# EAGLE design furballv3 (EAGLE 9.3.2)
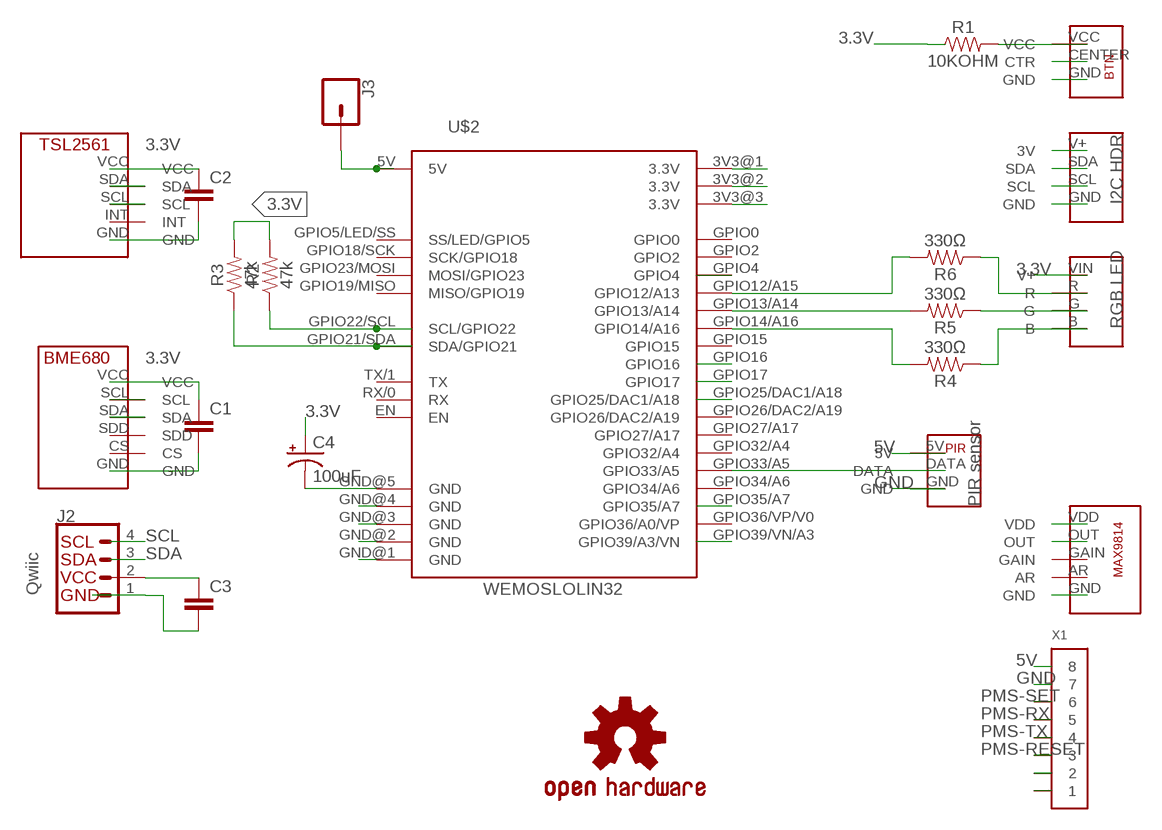
[diagram p0: schematic, sheet 1]

## Parts
C1  10pF  CAPPTH2  [CAP-PTH-SMALL2]
C2  10pF  CAPPTH2  [CAP-PTH-SMALL2]
C3  10pF  CAPPTH2  [CAP-PTH-SMALL2]
C4  100uF  100UF-POLAR-RADIAL-2.5MM-25V-20%  [CPOL-RADIAL-2.5MM-6.5MM]
J2  QWIIC_CONNECTORJS-1MM  [1X04_1MM_RA]
J3  CONN_01  [1X01]
LOGO1  OSHW-LOGOL  [OSHW-LOGO-L]
R1  10KOHM  47KOHM  [AXIAL-0.3-KIT]
R2  47k  100KOHM-HORIZ-1/4W-1%  [AXIAL-0.3]
R3  47k  100KOHM-HORIZ-1/4W-1%  [AXIAL-0.3]
R4  330Ω  100KOHM-HORIZ-1/4W-1%  [AXIAL-0.3]
R5  330Ω  100KOHM-HORIZ-1/4W-1%  [AXIAL-0.3]
R6  330Ω  100KOHM-HORIZ-1/4W-1%  [AXIAL-0.3]
U$1  PIRHEADER  [PIRHEADER]
U$2  WEMOSLOLIN32  [LOLIN32VAR1]
U$3  BME680BREAKOUT  [BME680BREAKOUT]
U$4  TSL2561BREAKOUT  [TSL2561BREAKOUT]
U$5  RGBLEDHEADER  [RGBLEDHDR]
U$6  I2CHEADER  [I2CHEADER]
U$7  MAX9814BREAKOUT  [MAX9814BREAKOUT]
U$8  PUSHBUTTONHEADER  [PUSHBUTTONHEADER]
X1  CONN_8-1-53261  [PB-53261-08]

## Nets
3.3V [3.3V]: C1.1 C2.1 C3.1 C4.1(+) J2.2(VCC) R1.P$1 R2.P$2 R3.P$2 U$2.3V3@1(3.3V) U$2.3V3@2(3.3V) U$2.3V3@3(3.3V) U$3.VCC U$4.VCC U$5.VIN(V+) U$6.V+(3V) U$7.VDD
5V [5V]: J3.1 U$1.5V U$2.5V X1.8
BUTTON: U$2.GPIO35/A7 U$8.CENTER(CTR)
GND [GROUND]: C1.2 C2.2 C3.2 C4.2(-) J2.1(GND) U$1.GND U$2.GND@1(GND) U$2.GND@2(GND) U$2.GND@3(GND) U$2.GND@4(GND) U$2.GND@5(GND) U$3.GND U$4.GND U$6.GND U$7.GND U$8.GND X1.7
N$1: R5.P$1 U$5.G
N$2: R6.P$2 U$2.GPIO12/A15(GPIO12/A13)
N$3: U$1.DATA U$2.GPIO33/A5
N$4: R5.P$2 U$2.GPIO13/A14
N$5: R4.P$2 U$2.GPIO14/A16
N$6: R4.P$1 U$5.B
N$7: R6.P$1 U$5.R
N$8: R1.P$2 U$8.VCC
N$14: X1.2
N$15: X1.1
PMS-RESET: U$2.GPIO25/DAC1/A18 X1.3
PMS-RX: U$2.GPIO16 X1.5
PMS-SET: U$2.GPIO4 X1.6
PMS-TX: U$2.GPIO17 X1.4
SCL: J2.4(SCL) R2.P$1 U$2.GPIO22/SCL(SCL/GPIO22) U$3.SCL U$4.SCL U$6.SCL
SDA: J2.3(SDA) R3.P$1 U$2.GPIO21/SDA(SDA/GPIO21) U$3.SDA U$4.SDA U$6.SDA
SOUND: U$2.GPIO39/VN/A3(GPIO39/A3/VN) U$7.OUT
Unconnected: U$2.EN U$2.GPIO0 U$2.GPIO2 U$2.GPIO5/LED/SS(SS/LED/GPIO5) U$2.GPIO15 U$2.GPIO18/SCK(SCK/GPIO18) U$2.GPIO19/MISO(MISO/GPIO19) U$2.GPIO23/MOSI(MOSI/GPIO23) U$2.GPIO26/DAC2/A19 U$2.GPIO27/A17 U$2.GPIO32/A4 U$2.GPIO34/A6 U$2.GPIO36/VP/V0(GPIO36/A0/VP) U$2.RX/0(RX) U$2.TX/1(TX) U$3.CS U$3.SDD U$4.INT U$7.AR U$7.GAIN

## Notes on the sheet
- I2C HDR
- RGB LED
- PIR sensor
- Qwiic

## Library data of the parts
C1-C3 = SparkFun:CAP: Capacitor Standard 0603 ceramic capacitor, and 0.1" leaded capacitor.
C4 = SparkFun-Capacitors:100UF-POLAR: 100µF polarized capacitors A capacitor is a passive two-terminal electrical component used to store electrical energy temporarily in an electric field.; PROD_ID: CAP-08439
J2 = SparkFun-Connectors:QWIIC_CONNECTOR: SparkFun I2C Standard Qwiic Connector An SMD 1mm pitch JST connector makes it easy and quick (get it? Qwiic?) to connect I2C devices to each other. The Qwiic system <http://www.sparkfun.com/qwiic> enables fast and solderless connection between popular platforms and various sensors and actuators. We carry 200mm <https://www.sparkfun.com/products/14204>, 100mm <https://www.sparkfun.com/products/14205>, 50mm <https://www.sparkfun.com/products/14206>, and breadboard friendly <https://www.sparkfun.com/products/14207> Qwiic cables. We also offer 10 pcs strips <https://www.sparkfun.com/products/14323> the SMD connectors.
J3 = SparkFun-Connectors:CONN_01: Single connection point. Often used as Generic Header-pin footprint for 0.1 inch spaced/style header connections On any of the 0.1 inch spaced packages, you can populate with these: Break Away Headers - Straight <https://www.sparkfun.com/products/116> (PRT-00116) Break Away Male Headers - Right Angle <https://www.sparkfun.com/products/553> (PRT-00553) Female Headers <https://www.sparkfun.com/products/115> (PRT-00115) Break Away Headers - Machine Pin <https://www.sparkfun.com/products/117> (PRT-00117) Break Away Female Headers - Swiss Machine Pin <https://www.sparkfun.com/products/743> (PRT-00743) This device is also useful as a general connection point to wire up your design to another part of your project. Our various solder wires solder well into these plated through hole pads. Hook-Up Wire - Assortment (Stranded, 22 AWG) <https://www.sparkfun.com/products/11375> (PRT-11375) Hook-Up Wire - Assortment (Solid Core, 22 AWG) <https://www.sparkfun.com/products/11367> (PRT-11367) View the entire wire category on our website here <https://www.sparkfun.com/categories/141> Special notes: SMTSO-256-ET is a "flush mount" nut for a 4-40 screw. We mostly use this on specialty testbeds; it is a nice way to connect hardware to your PCB at an adjustable hieght. Also note, the SNAP packages are for using a snappable style connector. We sell a baggie of snaps and they are also used on two LilyPad designs: Snap Assortment - 30 pack (male and female) <https://www.sparkfun.com/products/11347> (DEV-11347) LilyPad Arduino SimpleSnap <https://www.sparkfun.com/products/10941> (DEV-10941) LilyPad SimpleSnap Protoboard <https://www.sparkfun.com/products/10940> (DEV-10940)
LOGO1 = SparkFun-Aesthetics:OSHW-LOGO: Open-Source Hardware (OSHW) Logo This logo indicates the piece of hardware it is found on incorporates a OSHW license and/or adheres to the definition of open source hardware found here: http://freedomdefined.org/OSHW
R1 = LOLIN32:47KOHM: 47kΩ resistor A resistor is a passive two-terminal electrical component that implements electrical resistance as a circuit element. Resistors act to reduce current flow, and, at the same time, act to lower voltage levels within circuits. - Wikipedia
R2-R6 = SparkFun-Resistors:100KOHM: 100kΩ resistor A resistor is a passive two-terminal electrical component that implements electrical resistance as a circuit element. Resistors act to reduce current flow, and, at the same time, act to lower voltage levels within circuits. - Wikipedia; PROD_ID: RES-12184; VALUE: 100k
U$1 = LOLIN32:PIRHEADER
U$2 = LOLIN32:WEMOSLOLIN32: WEMOS LOLIN32 CPU with Wifi and 4Gb flash storage
U$3 = LOLIN32:BME680BREAKOUT
U$4 = LOLIN32:TSL2561BREAKOUT
U$5 = LOLIN32:RGBLEDHEADER
U$6 = LOLIN32:I2CHEADER
U$7 = LOLIN32:MAX9814BREAKOUT
U$8 = LOLIN32:PUSHBUTTONHEADER
X1 = pel_molex:CONN_8-1

## Net classes
1 GROUND: width 0.229 mm
2 3.3V: width 0.229 mm
3 5V: width 0.229 mm

## Board
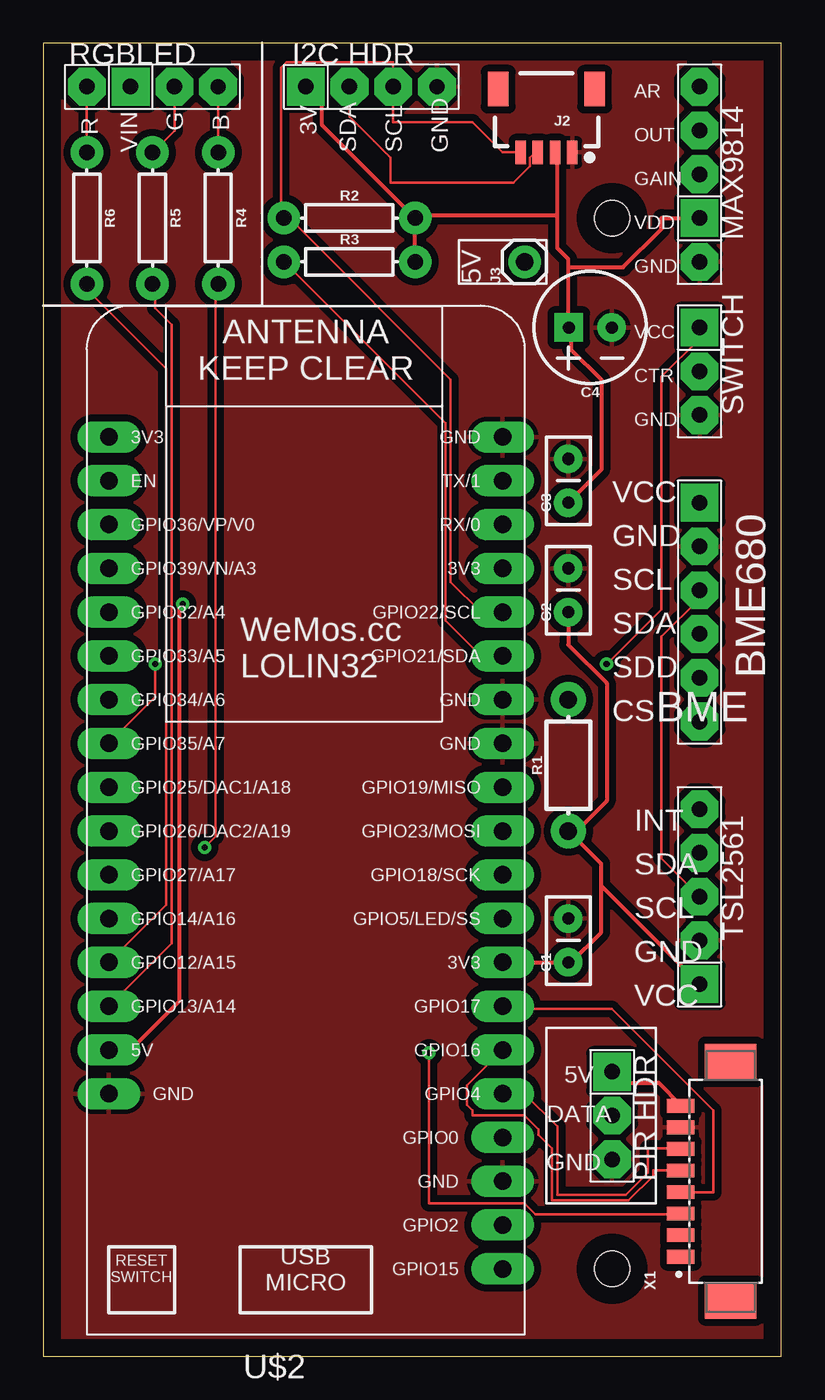
[diagram p1: board, top side]
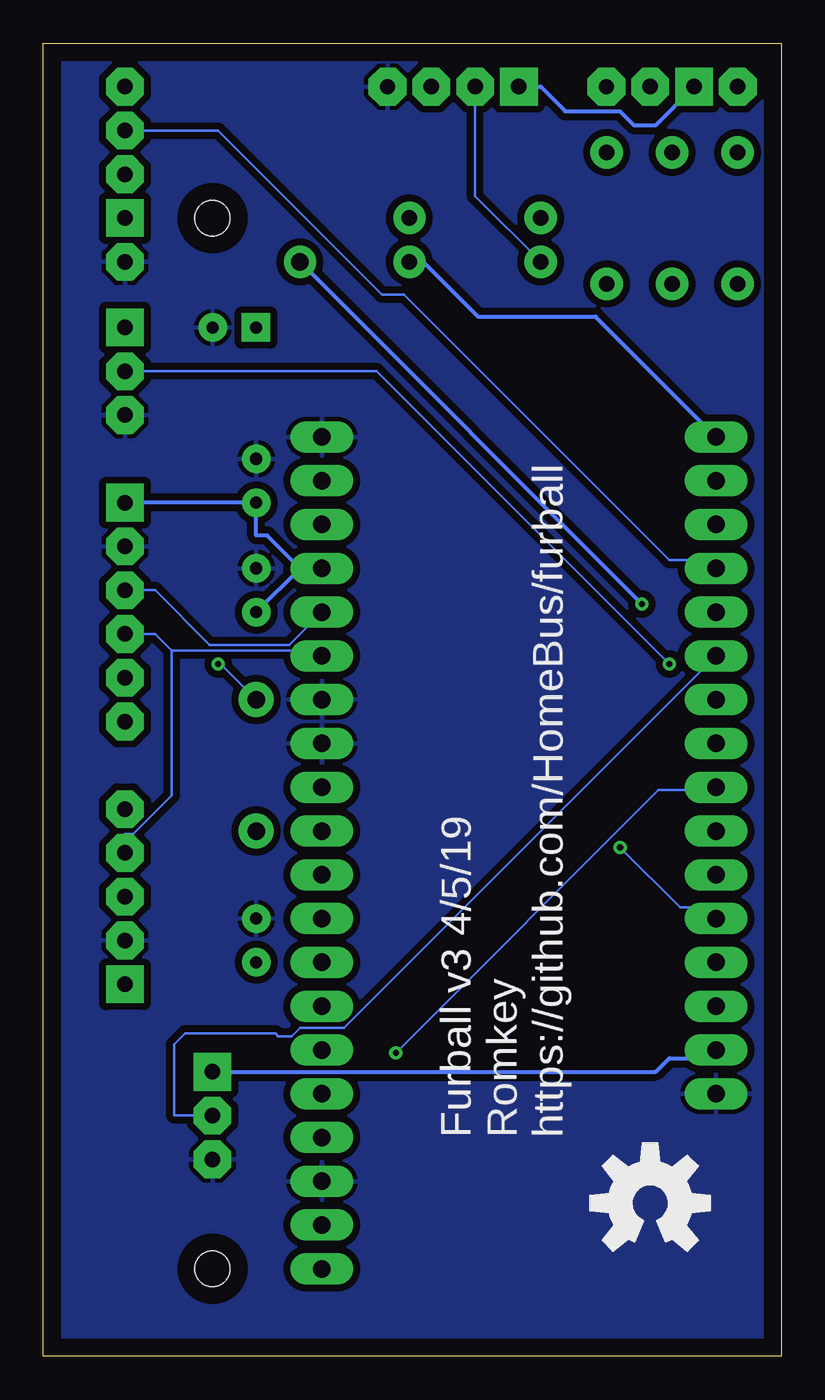
[diagram p2: board, bottom side, seen from below]

Size 42.85 x 76.19 mm. Coordinates in mm from the lower left corner, seen from the top.
Outline: 0,0 42.85,0 42.85,76.19 0,76.19 0,0
Copper layers (1*16): Top 0.035mm / dielectric 1.5mm / Bottom 0.035mm
Design rules "default *": minimum track width 6mil, minimum drill 0.35mm, track to track 6mil, track to pad 6mil, pad to pad 6mil, via to via 6mil, smd to smd 6mil, copper to edge 40mil, drill to drill 6mil, minimum pad ring 10mil, minimum via ring 8mil, stop-mask expansion 4mil, vias tented up to drill 0mil, thermal gap 10mil
Holes 2.03 mm at 33.02,66.04 33.02,5.08

### Footprints (pad centres in the part's own frame; a part is rotated, then mirrored left to right if it is on the bottom)
CAP-PTH-SMALL2 = drill 0.7 pad 1.651: 1 0,0; 2 2.54,0
CPOL-RADIAL-2.5MM-6.5MM = drill 0.7 pad 1.651 square: 1 1.25,0 | drill 0.7 pad 1.651: 2 -1.25,0
1X04_1MM_RA = smd 0.6 x 1.35: 1 -1.5,0; 2 -0.5,0; 3 0.5,0; 4 1.5,0 | smd 1.2 x 2: NC1 2.8,-3.675; NC2 -2.8,-3.675
1X01 = drill 1.016 pad 1.88: 1 0,0
AXIAL-0.3-KIT = drill 1.016 pad 2.032: P$1 -3.81,0; P$2 3.81,0
AXIAL-0.3 = drill 0.9 pad 1.88: P$1 -3.81,0; P$2 3.81,0
PIRHEADER = drill 0.9 pad 2.184 square: 5V 3.81,6.35 | drill 0.9 pad 2.184 octagon: DATA 3.81,3.81; GND 3.81,1.27
LOLIN32VAR1 = drill 1.016 pad 1.829 long: 3V3@1 -11.43,24.13; 3V3@2 11.43,16.51; 3V3@3 11.43,-6.35; 5V -11.43,-11.43; EN -11.43,21.59; GND@1 11.43,24.13; GND@2 11.43,8.89; GND@3 11.43,6.35; GND@4 11.43,-19.05; GND@5 -11.43,-13.97; GPIO0 11.43,-16.51; GPIO2 11.43,-21.59; GPIO4 11.43,-13.97; GPIO5/LED/SS 11.43,-3.81; GPIO12/A15 -11.43,-6.35; GPIO13/A14 -11.43,-8.89; GPIO14/A16 -11.43,-3.81; GPIO15 11.43,-24.13; GPIO16 11.43,-11.43; GPIO17 11.43,-8.89; GPIO18/SCK 11.43,-1.27; GPIO19/MISO 11.43,3.81; GPIO21/SDA 11.43,11.43; GPIO22/SCL 11.43,13.97; GPIO23/MOSI 11.43,1.27; GPIO25/DAC1/A18 -11.43,3.81; GPIO26/DAC2/A19 -11.43,1.27; GPIO27/A17 -11.43,-1.27; GPIO32/A4 -11.43,13.97; GPIO33/A5 -11.43,11.43; GPIO34/A6 -11.43,8.89; GPIO35/A7 -11.43,6.35; GPIO36/VP/V0 -11.43,19.05; GPIO39/VN/A3 -11.43,16.51; RX/0 11.43,19.05; TX/1 11.43,21.59
BME680BREAKOUT = drill 0.9 pad 2.184 octagon: CS 2.54,2.54; GND 2.54,12.7; SCL 2.54,10.16; SDA 2.54,7.62; SDD 2.54,5.08 | drill 0.9 pad 2.184 square: VCC 2.54,15.24
TSL2561BREAKOUT = drill 0.9 pad 2.184 octagon: GND 3.81,3.81; INT 3.81,11.43; SCL 3.81,6.35; SDA 3.81,8.89 | drill 0.9 pad 2.184 square: VCC 3.81,1.27
RGBLEDHDR = drill 0.85 pad 2.184 octagon: B 3.81,1.27 | drill 0.9 pad 2.184 octagon: G 3.81,3.81; R 3.81,8.89 | drill 0.9 pad 2.184 square: VIN 3.81,6.35
I2CHEADER = drill 0.85 pad 2.184 octagon: GND 3.81,1.27 | drill 0.9 pad 2.184 octagon: SCL 3.81,3.81; SDA 3.81,6.35 | drill 0.9 pad 2.184 square: V+ 3.81,8.89
MAX9814BREAKOUT = drill 0.9 pad 2.184 octagon: AR 1.27,11.43; GAIN 1.27,6.35; GND 1.27,1.27; OUT 1.27,8.89 | drill 0.9 pad 2.184 square: VDD 1.27,3.81
PUSHBUTTONHEADER = drill 0.9 pad 2.184 octagon: CENTER 1.27,3.81; GND 1.27,1.27 | drill 0.9 pad 2.184 square: VCC 1.27,6.35
PB-53261-08 = smd 0.8 x 1.6: 1 -4.375,1.1; 2 -3.125,1.1; 3 -1.875,1.1; 4 -0.625,1.1; 5 0.625,1.1; 6 1.875,1.1; 7 3.125,1.1; 8 4.375,1.1 | smd 2.1 x 3: MNT1 -6.925,-1.8; MNT2 6.925,-1.8

### Placement (x,y rotation side)
C1  30.48,22.86 90 top
C2  30.48,43.18 90 top
C3  30.48,49.53 90 top
C4  31.75,59.69 180 top
J2  29.21,69.85 180 top
J3  27.94,63.5 90 top
LOGO1  7.62,8.89 0 bottom
R1  30.48,34.29 90 top
R2  17.78,66.04 0 top
R3  17.78,63.5 0 top
R4  10.16,66.04 270 top
R5  6.35,66.04 270 top
R6  2.54,66.04 270 top
U$1  29.21,10.16 0 top
U$2  15.24,29.21 0 top
U$3  35.56,34.29 0 top
U$4  34.29,20.32 0 top
U$5  11.43,69.85 90 top
U$6  24.13,69.85 90 top
U$7  36.83,62.23 0 top
U$8  36.83,53.34 0 top
X1  38.1,10.16 90 top

### Tracks (layer width: path | path; a pad name or v marks a point on that pad's centre or on a via)
3.3V
  Top 0.229: U$2.3V3@3 C1.1 30.64,22.86 32.38,24.61 32.38,27.3 | 32.38,27.3 32.38,28.57 R1.P$1 30.8,30.32 32.7,32.23 32.7,39.05 30.48,41.27 C2.1 | 32.38,27.3 U$4.VCC | 29.84,66.2 29.84,64.29 30.48,63.66 30.48,63.18 | 29.84,66.2 29.84,69.85 J2.2 | 30.48,63.18 30.48,59.69 C4.1 30.64,59.69 30.64,58.42 32.38,56.67 32.38,51.44 C3.1 | U$7.VDD 35.88,66.04 35.88,65.41 33.66,63.18 30.48,63.18 | R3.P$2 R2.P$2 | U$6.V+ 16.19,72.71 16.19,71.44 R2.P$2 | 29.84,66.2 21.59,66.2 R2.P$2
  Bottom 0.229: 27.94,45.72 C2.1 | 27.94,45.72 29.84,47.62 30.48,47.62 C3.1 U$3.VCC | 27.94,45.72 U$2.3V3@2 | U$5.VIN 7.3,71.44 8.57,71.44 9.37,72.23 12.54,72.23 13.97,73.66 U$6.V+ | U$2.3V3@1 10.79,60.33 17.62,60.33 20.8,63.5 R3.P$2
5V  (via drill 0.35)
  Top 0.229: U$1.5V 33.02,15.88 35.72,15.88 36.99,14.61 X1.8 | v8.1,43.66 7.94,43.5 7.94,20.64 5.08,17.78 U$2.5V
  Bottom 0.229: U$2.5V 4.29,17.3 6.51,17.3 7.3,16.51 U$1.5V | v8.1,43.66 J3.1
BUTTON  (via drill 0.35)
  Top 0.152: U$2.GPIO35/A7 6.51,38.26 v6.51,40.16
  Bottom 0.152: v6.51,40.16 23.5,57.15 U$8.CENTER
GND
  pour Top (isolate 0.406): 0,76.2 41.91,76.2 41.91,0 0,0
  pour Bottom (isolate 0.406): 0,76.2 41.91,76.2 41.91,0 0,0
N$1
  Top 0.152: R5.P$1 7.62,71.12 U$5.G
N$2
  Top 0.152: U$2.GPIO12/A15 7.14,26.19 7.14,57.31 2.54,61.91 R6.P$2
N$3
  Bottom 0.152: U$2.GPIO33/A5 25.4,19.05 27.94,19.05 28.42,18.57 29.21,18.57 29.37,18.73 34.61,18.73 35.24,18.1 35.24,13.97 U$1.DATA
N$4
  Top 0.152: U$2.GPIO13/A14 7.46,23.97 7.46,59.85 6.51,60.8 6.51,62.07 R5.P$2
N$5  (via drill 0.35)
  Top 0.152: v9.37,29.53 10,30.16 10,62.07 R4.P$2
  Bottom 0.152: U$2.GPIO14/A16 4.45,26.04 5.87,26.04 v9.37,29.53
N$6
  Top 0.152: U$5.B R4.P$1
N$7
  Top 0.152: U$5.R R6.P$1
N$8  (via drill 0.35)
  Top 0.152: v32.7,40.16 35.88,43.34 35.88,56.83 38.1,59.05 U$8.VCC
  Bottom 0.152: R1.P$2 32.54,40.16 v32.7,40.16
PMS-RESET  (via drill 0.35)
  Top 0.152: v22.38,17.62 22.38,8.89 27.94,8.89 28.57,8.26 36.99,8.26 X1.3
  Bottom 0.152: v22.38,17.62 7.14,32.86 3.97,32.86 U$2.GPIO25/DAC1/A18
PMS-RX
  Top 0.152: U$2.GPIO16 24.61,15.72 24.61,14.61 24.92,14.29 24.92,13.97 27.94,13.97 28.73,13.18 28.73,12.86 29.53,12.06 29.53,9.05 33.97,9.05 35.4,10.48 35.4,10.79 36.99,10.79 X1.5
PMS-SET
  Top 0.152: U$2.GPIO4 27.94,15.24 29.84,13.34 29.84,9.37 33.81,9.37 35.08,10.64 35.08,12.06 36.99,12.06 X1.6
PMS-TX
  Top 0.152: U$2.GPIO17 26.67,20.16 33.02,20.16 38.89,14.29 38.89,9.53 37.15,9.53 X1.4
SCL
  Top 0.152: J2.4 26.67,69.85 24.92,71.6 20.32,71.6 U$6.SCL 20.32,75.09 14.13,75.09 13.81,74.77 13.81,66.2 R2.P$1 14.76,66.04 14.76,65.56 23.65,56.67 23.65,44.93 25.4,43.18 U$2.GPIO22/SCL | U$4.SCL 35.88,28.89 35.88,41.75 38.1,43.97 U$3.SCL
  Bottom 0.152: U$2.GPIO22/SCL 28.57,41.27 33.18,41.27 36.35,44.45 U$3.SCL
SDA
  Top 0.152: U$6.SDA 17.78,71.91 20.16,69.53 20.16,68.1 27.3,68.1 28.26,69.06 28.26,69.53 28.57,69.85 J2.3 | R3.P$1 23.34,54.13 23.34,42.7 25.4,40.64 U$2.GPIO21/SDA
  Bottom 0.152: R3.P$1 17.78,67.31 U$6.SDA | U$2.GPIO21/SDA 26.99,40.96 35.4,40.96 | 35.4,40.96 36.35,41.91 U$3.SDA | U$4.SDA 38.1,30.32 37.62,30.32 35.4,32.54 35.4,40.96
SOUND
  Bottom 0.152: U$2.GPIO39/VN/A3 4.29,46.2 6.51,46.2 21.91,61.59 23.18,61.59 32.7,71.12 U$7.OUT

### Text on the board
tPlace: 5V | BME
bPlace: Furball v3 4/5/19 / Romkey / https://github.com/HomeBus/furball